# Altium project METR2800.PrjPcb
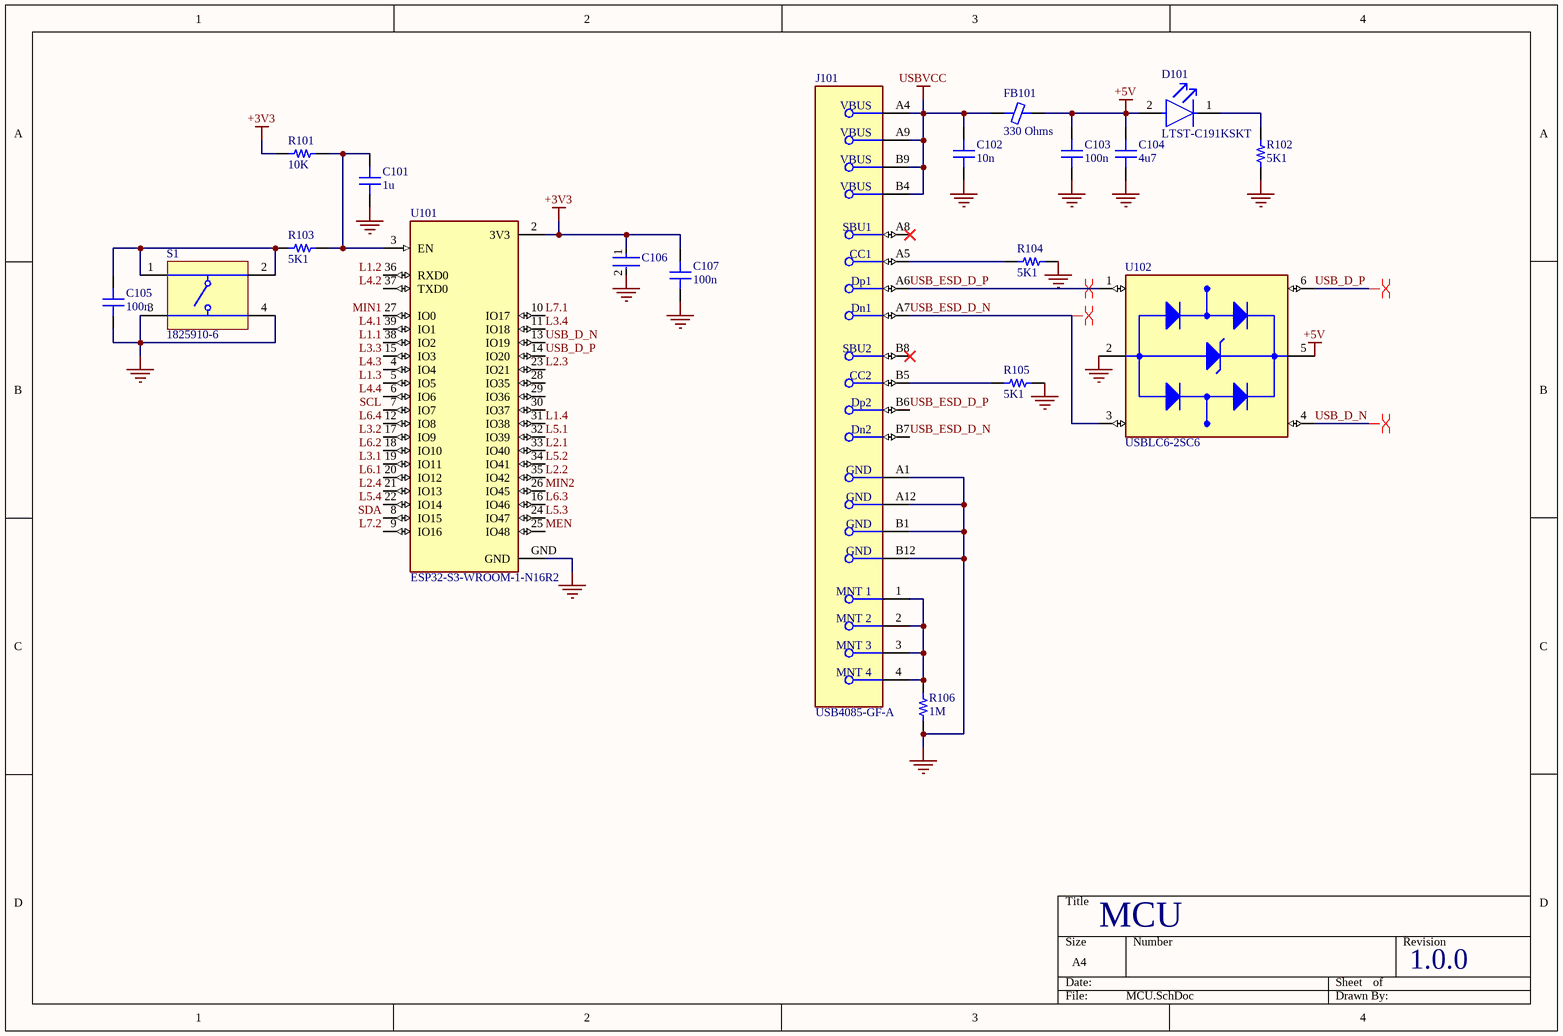
[diagram p0: MCU.SchDoc]
4 sheets, 150 parts. Net scope: global (net labels, ports and power ports of the same name join across sheets).
Board file: pcb.PcbDoc
Sheets:
  MCU.SchDoc
  Motors.SchDoc
  Limit Switches.SchDoc
  Power.SchDoc

## Sheet MCU.SchDoc
size A4; SheetNumber: 1; SheetTotal: 4

### Parts
C101  1u  [CAP 0402_1005]
C102  10n  [CAP 0402_1005]
C103  100n  [CAP 0402_1005]
C104  4u7  [CAP 0603_1608]
C105  100n  [CAP 0402_1005]
C106  C2012X5R1V226M125AC  [FP-C2012-125-0_2-IPC_C]  (value not drawn)
C107  100n  [CAP 0402_1005]
D101  LTST-C191KSKT  [FP-LTST-C191KSKT-MFG]
FB101  330 Ohms  [FER 0402_1005]
J101  USB4085-GF-A  [FP-USB4085-GF-A-MFG]
R101  10K  [RES 0402_1005]
R102  5K1  [RES 0402_1005]
R103  5K1  [RES 0402_1005]
R104  5K1  [RES 0402_1005]
R105  5K1  [RES 0402_1005]
R106  1M  [RES 0402_1005]
S1  1825910-6  [TECO-1825910-6_V]
U101  ESP32-S3-WROOM-1-N16R2  [XCVR_ESP32-S3-WROOM-1-N16R2]
U102  USBLC6-2SC6  [SOT95P280X145-6N]

### Nets
+3V3: C106.1 C107.2 R101.2 U101.2(3V3)
+5V: C103.2 C104.2 D101.2(A) FB101.2 U102.5(VBUS)
GND: C101.1 C102.1 C103.1 C104.1 C105.1 C106.2 C107.1 J101.A1(GND) J101.A12(GND) J101.B1(GND) J101.B12(GND) R102.1 R104.1 R105.1 R106.1 S1.3 S1.4 U101.GND U102.2(GND)
USBVCC: C102.2 FB101.1 J101.A4(VBUS) J101.A9(VBUS) J101.B4(VBUS) J101.B9(VBUS)
L1.1: U101.38(IO2)
L1.2: U101.36(RXD0)
L1.3: U101.5(IO5)
L1.4: U101.31(IO38)
L2.1: U101.33(IO40)
L2.2: U101.35(IO42)
L2.3: U101.23(IO21)
L2.4: U101.21(IO13)
L3.1: U101.19(IO11)
L3.2: U101.17(IO9)
L3.3: U101.15(IO3)
L3.4: U101.11(IO18)
L4.1: U101.39(IO1)
L4.2: U101.37(TXD0)
L4.3: U101.4(IO4)
L4.4: U101.6(IO6)
L5.1: U101.32(IO39)
L5.2: U101.34(IO41)
L5.3: U101.24(IO47)
L5.4: U101.22(IO14)
L6.1: U101.20(IO12)
L6.2: U101.18(IO10)
L6.3: U101.16(IO46)
L6.4: U101.12(IO8)
L7.1: U101.10(IO17)
L7.2: U101.9(IO16)
MEN: U101.25(IO48)
MIN1: U101.27(IO0)
MIN2: U101.26(IO45)
SCL: U101.7(IO7)
SDA: U101.8(IO15)
USB_D_N: U101.13(IO19) U102.4(I/O2_OUT)
USB_D_P: U101.14(IO20) U102.6(I/O1_OUT)
USB_ESD_D_N: J101.A7(Dn1) J101.B7(Dn2) U102.3(I/O2_IN)
USB_ESD_D_P: J101.A6(Dp1) J101.B6(Dp2) U102.1(I/O1_IN)
NetC101_2: C101.2 R101.1 R103.1 U101.3(EN)
NetC105_2: C105.2 R103.2 S1.1 S1.2
NetD101_1: D101.1(C) R102.2
NetJ101_1: J101.1(MNT_1) J101.2(MNT_2) J101.3(MNT_3) J101.4(MNT_4) R106.2
NetJ101_A5: J101.A5(CC1) R104.2
NetJ101_B5: J101.B5(CC2) R105.2

Not connected (* = marked no-connect by the designer): J101 A8(SBU1)* B8(SBU2)*; U101 28(IO35) 29(IO36) 30(IO37)

### Layout directives
differential pair: USB_D_N, USB_D_P, USB_ESD_D_N, USB_ESD_D_P

### Notes on the sheet
- MCU
- 1.0.0

### Library data of the parts
C101-C103 C105 C107 = CL05B104KP5VPNC: CAP CER 100NF 10V X7R 0402; manufacturer: Samsung Electro-Mechanics; Capacitance: 0.1 µF; Tolerance: ±10%; Part Number: CL05B104KP5VPNC; Applications: Automotive; componentlink1description: Datasheet; componentlink1url: https://mm.digikey.com/Volume0/opasdata/d220001/medias/docus/5458/CL05B104KP5VPNC_Spec.pdf; componentlink2description: DigiKey Link; componentlink2url: https://www.digikey.com/en/products/detail/samsung-electro-mechanics/CL05B104KP5VPNC/20498482; Device Package: 0402 (1005 Metric); lastupdated: 9/02/2024 8:03:17 PM; Lifecycle Status: Active; Minimum Order: 1; Mounting Type: Surface Mount, MLCC; Operating Temperature: -55°C ~ 125°C; Package / Case: 0402 (1005 Metric); packaging: TapeAndReel; partid: 56690; price: 0.01; Ratings: AEC-Q200; series: CL; Size / Dimension: 0.039" L x 0.020" W (1.00mm x 0.50mm); Supplier 1: DigiKey; Supplier Part Number 1: 1276-CL05B104KP5VPNCCT-ND; Temperature Coefficient: X7R; Thickness (Max): 0.022" (0.55mm); Voltage - Rated: 10V
  C101: Value: 1u
  C102: Value: 10n
  C103 C105 C107: Value: 100n
C104 = CL10A475KA8NQNC: CAP CER 4.7UF 25V X5R 0603; manufacturer: Samsung Electro-Mechanics; Capacitance: 4.7 µF; Tolerance: ±10%; Part Number: CL10A475KA8NQNC; Value: 4u7; Applications: General Purpose; componentlink1description: Datasheet; componentlink1url: http://www.samsungsem.com/kr/support/product-search/mlcc/CL10A475KA8NQNC.jsp; componentlink2description: DigiKey Link; componentlink2url: https://www.digikey.com/en/products/detail/samsung-electro-mechanics/CL10A475KA8NQNC/3887558; Device Package: 0603 (1608 Metric); lastupdated: 9/02/2024 8:10:30 PM; Lifecycle Status: Active; Minimum Order: 1; Mounting Type: Surface Mount, MLCC; Operating Temperature: -55°C ~ 85°C; Package / Case: 0603 (1608 Metric); packaging: TapeAndReel; partid: 2349; Part Status: Active; price: 0.06; series: CL; Size / Dimension: 0.063" L x 0.031" W (1.60mm x 0.80mm); Supplier 1: DigiKey; Supplier Part Number 1: 1276-1900-1-ND; Temperature Coefficient: X5R; Thickness (Max): 0.035" (0.90mm); Voltage - Rated: 25V
C106 = CMP-2000-06038-3: Multilayer Ceramic Capacitors 22μF ±20% 35V X5R SMD 0805; Capacitance: 22uF; Tolerance: 20%; RoHS Compliant: Yes; Height: 1.25mm; Termination: SMD/SMT; Case/Package: 0805; Thickness: 0.057inch; Max Operating Temperature: 85°C; Min Operating Temperature: -55°C; Voltage Rating (DC): 35V; Length: 0.079inch; Dielectric: X5R; Dielectric Material: Ceramic; Voltage Rating: 35V; Mount: Surface Mount; Package Quantity: 2000; Lead Free: Lead Free; Weight: 0.000194oz; REACH SVHC: No SVHC; Width: 0.049inch; Packaging: Tape and Reel; Series: C; Case Code (Metric): 2012; Case Code (Imperial): 0805
D101 = CMP-22017-000025-1: LED YELLOW CLEAR SMD; Dominant Wavelength: 597nm; Power Rating: 75mW; Number of LEDs: 1; Lens Style: Diffused; Forward Current: 30mA; Test Current: 20mA; Forward Voltage: 2.4V; Wavelength: 588nm; Viewing Angle: 130°; Lens Color: Colorless; Reverse Voltage: 5V; Luminous Intensity: 180mcd; Case Code (Imperial): 0603; Width: 0.8mm; Power Dissipation: 75mW; Length: 1.6mm; Illumination Color: Yellow; Number of Pins: 2; Case Code (Metric): 1608; Mount: Surface Mount; Number of Elements: 1; Height: 0.55mm; Lens Transparency: Clear; Depth: 0.8mm; Min Operating Temperature: -55°C; Case/Package: 0603; Radiation Hardening: No; Max Operating Temperature: 85°C; Package Quantity: 1; Packaging: Tape and Reel; Lead Free: Lead Free; Color: Yellow
FB101 = Z0402C121ASMST: FERRITE BEAD 120 OHM 0402 1LN; Manufacturer: KEMET; Current Rating (Max): 500mA; DC Resistance (DCR) (Max): 230mOhm; Filter Type: Signal Line; Impedance @ Frequency: 120 Ohms @ 100MHz; Number of Lines: 1; Value: 120 Ohms @ 100MHz; Part Number: Z0402C121ASMST; ComponentLink1Description: Datasheet; ComponentLink1URL: https://content.kemet.com/datasheets/F3115.pdf; ComponentLink2Description: DigiKey Link; ComponentLink2URL: http://digikey.com/product-detail/en/kemet/Z0402C121ASMST/399-17794-1-ND/8601457; Device Package: 0402 (1005 Metric); Height (Max): 0.022" (0.55mm); LastUpdated: 11/03/2024 7:42:43 AM; Lifecycle Status: Active; Minimum Order: 1; Mounting Type: Surface Mount; Operating Temperature: -55°C ~ 125°C; Package / Case: 0402 (1005 Metric); Packaging: TapeAndReel; PartId: 159; Part Status: Active; Price: 0.03; Series: Z-SMS; Size / Dimension: 0.039" L x 0.020" W (1.00mm x 0.50mm); Supplier 1: DigiKey; Supplier Part Number 1: 399-17794-1-ND
J101 = CMP-196119-000001-2: CONN RCPT USB2.0 TYPE C 24POS RA; Gender: Receptacle; Number of Positions: 16; USB Standard: USB 2.0; Orientation: Right Angle; Contact Plating: Gold; Contact Material: Copper Alloy
R101-R106 = AC0402JR-075K1L: RES SMD 5.1K OHM 5% 1/16W 0402; Manufacturer: Yageo; Power (Watts): 0.063W, 1/16W; Resistance: 5.1 kOhms; Temperature Coefficient: ±100ppm/°C; Part Number: AC0402JR-075K1L; ComponentLink1Description: Datasheet; ComponentLink1URL: https://www.yageo.com/upload/media/product/productsearch/datasheet/rchip/PYu-AC_51_RoHS_L_7.pdf; ComponentLink2Description: DigiKey Link; ComponentLink2URL: https://www.digikey.com/en/products/detail/yageo/AC0402JR-075K1L/5895695; Composition: Thick Film; Device Package: 0402 (1005 Metric); Features: Automotive AEC-Q200, Moisture Resistant; Height - Seated (Max): 0.015" (0.37mm); LastUpdated: 9/02/2024 8:30:14 PM; Lifecycle Status: Active; Minimum Order: 1; Number of Terminations: 2; Operating Temperature: -55°C ~ 155°C; Package / Case: 0402 (1005 Metric); Packaging: CutTape; PartId: 4690; Part Status: Active; Price: 0.01; Ratings: AEC-Q200; Series: AC; Size / Dimension: 0.039" L x 0.020" W (1.00mm x 0.50mm); Supplier 1: DigiKey; Supplier Part Number 1: YAG3554CT-ND; Supplier Device Package: 0402; Tolerance: ±5%
  R101: Value: 10K
  R102-R105: Value: 5K1
  R106: Value: 1M
S1 = CMP-1684-00021-1: Tact Switch, SPST-NO, 0.05 A, -35 to 85 degC, 4-Pin THD, RoHS, Bulk; Manufacturer: TE Connectivity; Maximum Contact Resistance: 100mOhm; Mechanical Life: 100000Cycles; Bushing Type: Unthreaded; Switch Configuration: OFF(ON); Maximum DC Voltage Rating: 24V; Contact Rating @ Voltage: 0.05A@24VDC; Actuator Color: Black; Body Orientation: Straight; Function: MomentaryContact; Illumination: N/R; Actuator Style: RoundButton; Actuator Material: PolybutyleneTerephthalate; Dielectric Strength: 500VAC; Pole Throw Configuration: SPST; Actuator Length: 1.4mm; Product Weight: N/A; Contact Material: CopperAlloy; Housing Material: N/A; Terminal Type: PCPins; Minimum Insulation Resistance: 100MOhm; Package Description: 4-Pin Through Hole Device, Body 5.99 x 5.99 mm, Pitch 6.5 mm; Part No: 1825910-6; Package Reference: THD; Base Material: N/A; Manufacturer URL: http://www.te.com; Contact Plating: Silver; RoHS: Yes; Datasheet Version: Rev. C9; Electrical Life: 100000Cycles; Maximum AC Voltage Rating: N/A; Thread Size: N/R; Operating Temperature: -35to85C; Mounting: ThroughHole; Dimension: 5.99x5mm; Datasheet URL: http://www.te.com/commerce/DocumentDelivery/DDEController?Action=showdoc&DocId=Customer+Drawing%7F1825910%7FC9%7Fpdf%7FEnglish%7FENG_CD_1825910_C9.pdf%7F1825910-6; Family: 1825910; Seal Location: N/A; Seal Description: N/A; Packaging: N/A
U101 = ESP32-S3-WROOM-1-N16R2: Bluetooth, WiFi 802.11b/g/n, Bluetooth v5.0 Transceiver Module 2.4GHz PCB Trace Surface Mount; MF: Espressif Systems; MP: ESP32S3WROOM1N16R2; SnapEDA_Link: https://www.snapeda.com/parts/ESP32S3WROOM1N16R2/Espressif+Systems/view-part/?ref=snap; Package: NON STANDARD Espressif Systems; Value: *; Check_prices: https://www.snapeda.com/parts/ESP32S3WROOM1N16R2/Espressif+Systems/view-part/?ref=eda
U102 = USBLC6-2SC6: 17V Clamp 5A (8/20Âµs) Ipp Tvs Diode Surface Mount SOT-23-6; MF: STMicroelectronics; Value: *; SnapEDA_Link: https://www.snapeda.com/parts/USBLC6-2SC6/STMicroelectronics/view-part/?ref=snap; Check_prices: https://www.snapeda.com/parts/USBLC6-2SC6/STMicroelectronics/view-part/?ref=eda; Purchase-URL: https://pricing.snapeda.com/search/part/USBLC6-2SC6/?ref=eda; Price: None; Availability: In Stock; Package: SOT-23-6 STMicroelectronics; MP: USBLC6-2SC6

## Sheet Motors.SchDoc
size A4; SheetNumber: 2; SheetTotal: 4
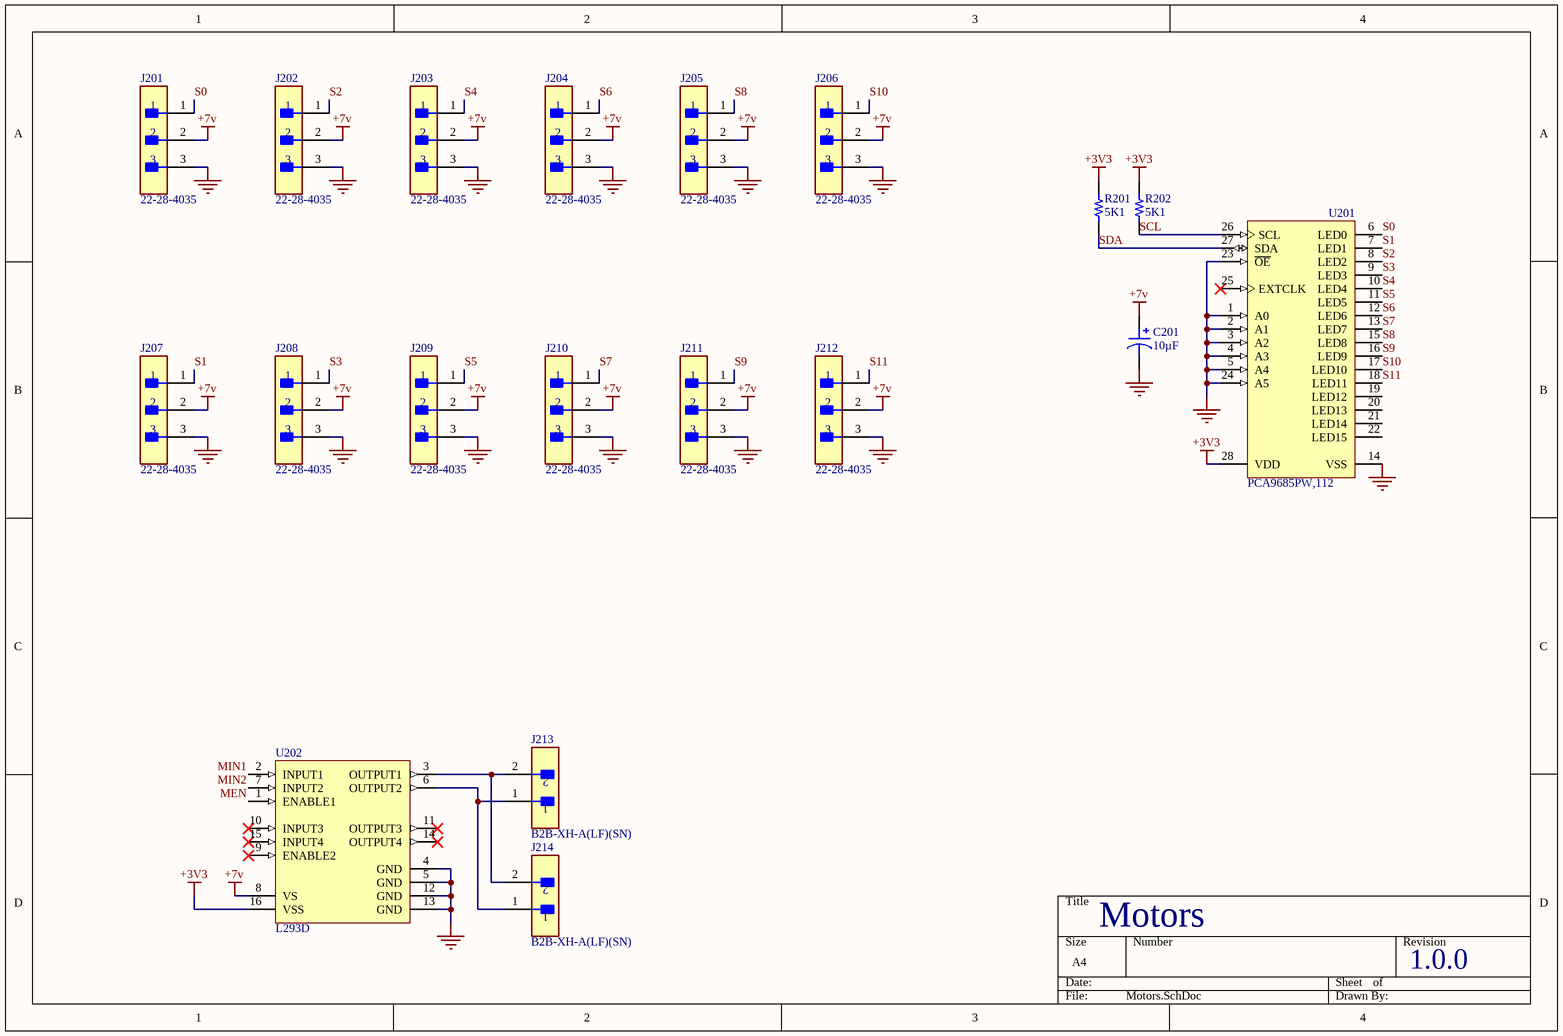
[diagram p1: Motors.SchDoc]

### Parts
C201  10µF  [CAP TH ALUM ELEC D10.00mm S5.00mm H12.50mm]
J201  22-28-4035  [FP-22-28-4035-MFG]
J202  22-28-4035  [FP-22-28-4035-MFG]
J203  22-28-4035  [FP-22-28-4035-MFG]
J204  22-28-4035  [FP-22-28-4035-MFG]
J205  22-28-4035  [FP-22-28-4035-MFG]
J206  22-28-4035  [FP-22-28-4035-MFG]
J207  22-28-4035  [FP-22-28-4035-MFG]
J208  22-28-4035  [FP-22-28-4035-MFG]
J209  22-28-4035  [FP-22-28-4035-MFG]
J210  22-28-4035  [FP-22-28-4035-MFG]
J211  22-28-4035  [FP-22-28-4035-MFG]
J212  22-28-4035  [FP-22-28-4035-MFG]
J213  B2B-XH-A(LF)(SN)  [FP-B2B-XH-A_LF_SN-MFG]
J214  B2B-XH-A(LF)(SN)  [FP-B2B-XH-A_LF_SN-MFG]
R201  5K1  [RES 0402_1005]
R202  5K1  [RES 0402_1005]
U201  PCA9685PW,112  [SOT361-1_V]
U202  L293D  [STM-L293D-16]

### Nets
+3V3: R201.2 R202.1 U201.28(VDD) U202.16(VSS)
+7v: C201.1 J201.2 J202.2 J203.2 J204.2 J205.2 J206.2 J207.2 J208.2 J209.2 J210.2 J211.2 J212.2 U202.8(VS)
GND: C201.2 J201.3 J202.3 J203.3 J204.3 J205.3 J206.3 J207.3 J208.3 J209.3 J210.3 J211.3 J212.3 U201.1(A0) U201.2(A1) U201.3(A2) U201.4(A3) U201.5(A4) U201.14(VSS) U201.23(~{OE}) U201.24(A5) U202.4(GND) U202.5(GND) U202.12(GND) U202.13(GND)
MEN: U202.1(ENABLE1)
MIN1: U202.2(INPUT1)
MIN2: U202.7(INPUT2)
S0: J201.1 U201.6(LED0)
S1: J207.1 U201.7(LED1)
S2: J202.1 U201.8(LED2)
S3: J208.1 U201.9(LED3)
S4: J203.1 U201.10(LED4)
S5: J209.1 U201.11(LED5)
S6: J204.1 U201.12(LED6)
S7: J210.1 U201.13(LED7)
S8: J205.1 U201.15(LED8)
S9: J211.1 U201.16(LED9)
S10: J206.1 U201.17(LED10)
S11: J212.1 U201.18(LED11)
SCL: R202.2 U201.26(SCL)
SDA: R201.1 U201.27(SDA)
NetJ213_1: J213.1 J214.1 U202.6(OUTPUT2)
NetJ213_2: J213.2 J214.2 U202.3(OUTPUT1)

Not connected (* = marked no-connect by the designer): U201 19(LED12) 20(LED13) 21(LED14) 22(LED15) 25(EXTCLK)*; U202 9(ENABLE2)* 10(INPUT3)* 11(OUTPUT3)* 14(OUTPUT4)* 15(INPUT4)*

### Notes on the sheet
- Motors
- 1.0.0

### Library data of the parts
C201 = UVR2D100MPD: CAP ALUM 10UF 20% 200V RADIAL; manufacturer: Nichicon; Lifetime @ Temp.: 2000 Hrs @ 85°C; Polarization: Polar; Ripple Current @ High Frequency: 152mA @ 10kHz; Ripple Current @ Low Frequency: 95mA @ 120Hz; Part Number: UVR2D100MPD; Applications: General Purpose; Capacitance: 10µF; componentlink1description: Datasheet; componentlink1url: http://nichicon-us.com/english/products/pdfs/e-uvr.pdf; componentlink2description: DigiKey Link; componentlink2url: http://digikey.com/product-detail/en/nichicon/UVR2D100MPD/493-1177-ND/588918; Device Package: Radial, Can; Height - Seated (Max): 0.492" (12.50mm); lastupdated: 2/09/2020 1:31:04 AM; Lead Spacing: 0.197" (5.00mm); Lifecycle Status: Active; Minimum Order: 1; Mounting Type: Through Hole; Operating Temperature: -40°C ~ 85°C; Package / Case: Radial, Can; packaging: Bulk; partid: 10668; Part Status: Active; price: 0.45; series: UVR; Size / Dimension: 0.394" Dia (10.00mm); Supplier 1: DigiKey; Supplier Part Number 1: 493-1177-ND; Tolerance: ±20%; value: 10µF; Voltage - Rated: 200V
J201-J212 = CMP-00257-00247547-1: 22-28-4035 BOARD-BOARD Connector HEADER, 3WAY, 1ROW; Series: KK; Pitch Spacing: 2.54mm; No. of Rows: 1;; Manufacturer Lifecycle Status: ACTIVE; NexarPartId: 247547; Plating: Tin; Max Voltage Rating (DC): 250.25kV; Voltage Rating: 250V; Current Rating: 4A; Gender: Male; Glow Wire Compliant: Non-compliant; Number of Positions: 3; Connector Type: Male Pin; Contact Resistance: 20mΩ; Color: Black; Contact Plating: Gold; Contact Material: Brass; Lead Free: Lead Free; Number of Rows: 1; Housing Material: Thermoplastic; Min Operating Temperature: 0°C; Country of Origin: US; REACH SVHC: Unknown; Lifecycle Status: Production; Mount: Through Hole; Schedule B: 8536694040; RoHS: Compliant; Termination: Through Hole; Max Operating Temperature: 75°C; Pitch: 2.54mm; Packaging: Bulk; Number of Circuits: 3; Contact Mating Length: 7.493mm; Orientation: Vertical; Housing Color: Black; Number of Contacts: 3
J213 J214 = CMP-2000-05888-3: CONN HEADER VERT 2POS 2.5MM; Current Rating: 3A; Voltage Rating: 250V; Number of Contacts: 2; Contact Resistance: 20mR; Wire/Cable Gauge: 22AWG; Insulation Resistance: 1GR; Connector Type: Male Pin; Packaging: Bulk; Contact Material: Brass; Lead Free: Lead Free; Orientation: Straight; Contact Plating: Tin; Max Current Rating: 3A; Termination: Solder; Fastening Type: Detent; Depth: 5.75mm; Housing Material: Polyamide; REACH SVHC: No SVHC; Series: XH; Voltage Rating (AC): 250V; Number of Positions: 2; Color: Natural; Contact Type: Male Pin; Max Voltage Rating (DC): 250V; Pitch: 2.5mm; Lead Pitch: 2.5mm; Mount: Through Hole; Max Operating Temperature: 85°C; Length: 7.4mm; Max Voltage Rating (AC): 250V; Min Operating Temperature: -25°C; Number of Rows: 1; Housing Color: White
R201 R202 = AC0402JR-075K1L: as R101 on sheet MCU; Part Number: AC0402JR-075K1L; Value: 5K1; ComponentLink1Description: Datasheet; ComponentLink1URL: https://www.yageo.com/upload/media/product/productsearch/datasheet/rchip/PYu-AC_51_RoHS_L_7.pdf; ComponentLink2Description: DigiKey Link; ComponentLink2URL: https://www.digikey.com/en/products/detail/yageo/AC0402JR-075K1L/5895695; Composition: Thick Film; Device Package: 0402 (1005 Metric); Features: Automotive AEC-Q200, Moisture Resistant; Height - Seated (Max): 0.015" (0.37mm); LastUpdated: 9/02/2024 8:30:14 PM; Lifecycle Status: Active; Minimum Order: 1; Number of Terminations: 2; Operating Temperature: -55°C ~ 155°C; Package / Case: 0402 (1005 Metric); Packaging: CutTape; PartId: 4690; Part Status: Active; Price: 0.01; Ratings: AEC-Q200; Series: AC; Size / Dimension: 0.039" L x 0.020" W (1.00mm x 0.50mm); Supplier 1: DigiKey; Supplier Part Number 1: YAG3554CT-ND; Supplier Device Package: 0402; Tolerance: ±5%
U201 = CMP-1595-00004-2: 16-Channel, 12-Bit PWM Fm+ I2C-Bus LED Controller, 2.3 to 5.5 V, -40 to 85 degC, 28-Pin TSSOP (SOT361-1), RoHS, Tape and Reel; Supply Current Max: 10 mA; Supply Voltage Min: 2.3 V; Supply Voltage Max: 5.5 V; Frequency: 25000000 Hz; Temperature Min: -40 degC; PackageDescription: 28-Pin Small Outline Package, Body 9.7 x 4.4 mm, Pitch 0.65 mm; RoHS: TRUE; ComponentLink1Description: Manufacturer URL; Code_JEDEC: MO-153; PartNumber: PCA9685; ComponentLink2URL: http://www.nxp.com/documents/data_sheet/PCA9685.pdf; Packing: Tape and Reel; ComponentLink1URL: http://www.nxp.com/; ComponentLink3Description: Package Specification; ComponentLink2Description: Datasheet; ComponentLink3URL: http://www.nxp.com/documents/outline_drawing/sot361-1_po.pdf; DatasheetVersion: Rev. 4; Temperature Max: 85 degC; PackageVersion: 02/2003; Mounting Technology: Surface Mount
U202 = CMP-2000-06524-1: Push-Pull Four Channel Driver with Diode, 4.5 to 36 V, -40 to 150 degC, 16-Pin PDIP, RoHS, Tube; Manufacturer: STMicroelectronics; Number of Outputs: 4; Current - Peak Output: 1.2A; Current - Output / Channel: 600mA; Input Type: Non-Inverting; Other Related Documents: L293DViewAllSpecifications; Dynamic Catalog: HalfBridge; Voltage - Supply: 4.5V~36V; Other Names: 497-2936-5; Package / Case: 16-DIP(0.300",7.62mm); PartNumber: L293D; Operating Temperature: -40°C~150°C; Datasheet URL: http://www.st.com/st-web-ui/static/active/en/resource/technical/document/datasheet/CD00000059.pdf; Supplier Device Package: 16-PowerDIP; Packaging: Tube; Package Description: 16-Pin Thru-Hole Dual-In-Line, Body 20 x 6.85 mm, Pitch 2.54 mm; Standard Package: 25; Datasheet Version: 07/2003; On-State Resistance: -; Manufacturer URL: http://www.st.com/; Category: IntegratedCircuits(ICs); Family: PMIC-MOSFET,BridgeDrivers-InternalSwitch; Type: HalfBridge; Series: -; Mounting Technology: ThroughHole; Package Reference: DIP-16; Mounting Type: ThroughHole

## Sheet Limit Switches.SchDoc
size A4; SheetNumber: 3; SheetTotal: 4
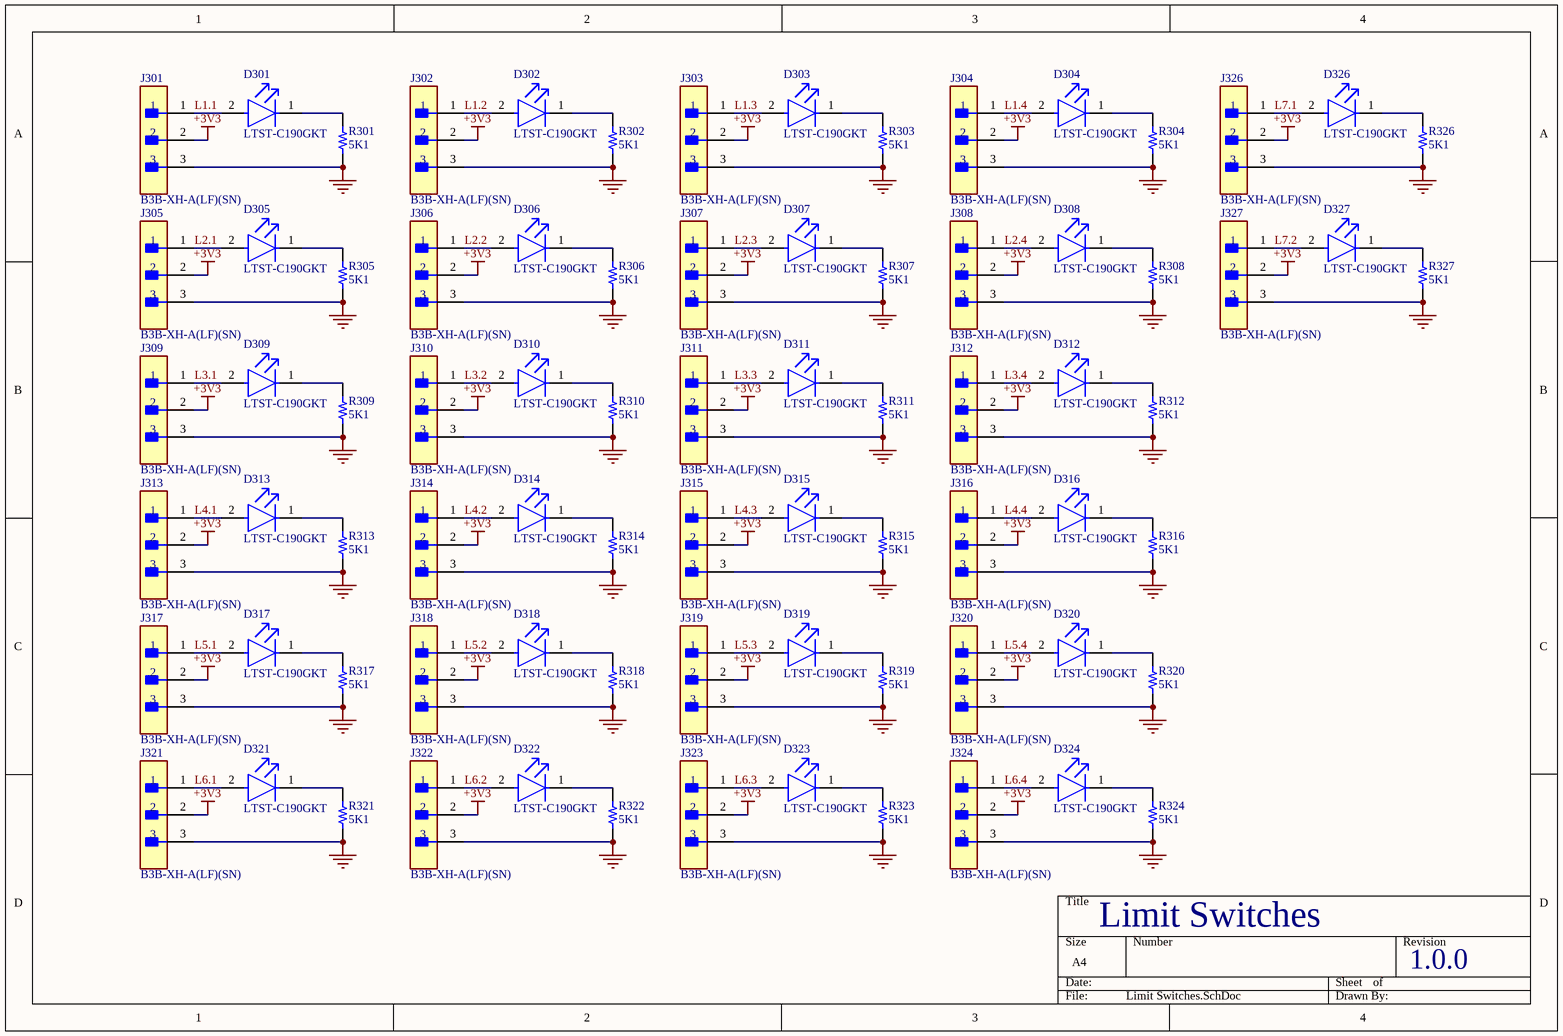
[diagram p2: Limit Switches.SchDoc]

### Parts
D301  LTST-C190GKT  [FP-LTST-C190GKT-MFG]
D302  LTST-C190GKT  [FP-LTST-C190GKT-MFG]
D303  LTST-C190GKT  [FP-LTST-C190GKT-MFG]
D304  LTST-C190GKT  [FP-LTST-C190GKT-MFG]
D305  LTST-C190GKT  [FP-LTST-C190GKT-MFG]
D306  LTST-C190GKT  [FP-LTST-C190GKT-MFG]
D307  LTST-C190GKT  [FP-LTST-C190GKT-MFG]
D308  LTST-C190GKT  [FP-LTST-C190GKT-MFG]
D309  LTST-C190GKT  [FP-LTST-C190GKT-MFG]
D310  LTST-C190GKT  [FP-LTST-C190GKT-MFG]
D311  LTST-C190GKT  [FP-LTST-C190GKT-MFG]
D312  LTST-C190GKT  [FP-LTST-C190GKT-MFG]
D313  LTST-C190GKT  [FP-LTST-C190GKT-MFG]
D314  LTST-C190GKT  [FP-LTST-C190GKT-MFG]
D315  LTST-C190GKT  [FP-LTST-C190GKT-MFG]
D316  LTST-C190GKT  [FP-LTST-C190GKT-MFG]
D317  LTST-C190GKT  [FP-LTST-C190GKT-MFG]
D318  LTST-C190GKT  [FP-LTST-C190GKT-MFG]
D319  LTST-C190GKT  [FP-LTST-C190GKT-MFG]
D320  LTST-C190GKT  [FP-LTST-C190GKT-MFG]
D321  LTST-C190GKT  [FP-LTST-C190GKT-MFG]
D322  LTST-C190GKT  [FP-LTST-C190GKT-MFG]
D323  LTST-C190GKT  [FP-LTST-C190GKT-MFG]
D324  LTST-C190GKT  [FP-LTST-C190GKT-MFG]
D326  LTST-C190GKT  [FP-LTST-C190GKT-MFG]
D327  LTST-C190GKT  [FP-LTST-C190GKT-MFG]
J301  B3B-XH-A(LF)(SN)  [FP-B3B-XH-A_LF_SN-MFG]
J302  B3B-XH-A(LF)(SN)  [FP-B3B-XH-A_LF_SN-MFG]
J303  B3B-XH-A(LF)(SN)  [FP-B3B-XH-A_LF_SN-MFG]
J304  B3B-XH-A(LF)(SN)  [FP-B3B-XH-A_LF_SN-MFG]
J305  B3B-XH-A(LF)(SN)  [FP-B3B-XH-A_LF_SN-MFG]
J306  B3B-XH-A(LF)(SN)  [FP-B3B-XH-A_LF_SN-MFG]
J307  B3B-XH-A(LF)(SN)  [FP-B3B-XH-A_LF_SN-MFG]
J308  B3B-XH-A(LF)(SN)  [FP-B3B-XH-A_LF_SN-MFG]
J309  B3B-XH-A(LF)(SN)  [FP-B3B-XH-A_LF_SN-MFG]
J310  B3B-XH-A(LF)(SN)  [FP-B3B-XH-A_LF_SN-MFG]
J311  B3B-XH-A(LF)(SN)  [FP-B3B-XH-A_LF_SN-MFG]
J312  B3B-XH-A(LF)(SN)  [FP-B3B-XH-A_LF_SN-MFG]
J313  B3B-XH-A(LF)(SN)  [FP-B3B-XH-A_LF_SN-MFG]
J314  B3B-XH-A(LF)(SN)  [FP-B3B-XH-A_LF_SN-MFG]
J315  B3B-XH-A(LF)(SN)  [FP-B3B-XH-A_LF_SN-MFG]
J316  B3B-XH-A(LF)(SN)  [FP-B3B-XH-A_LF_SN-MFG]
J317  B3B-XH-A(LF)(SN)  [FP-B3B-XH-A_LF_SN-MFG]
J318  B3B-XH-A(LF)(SN)  [FP-B3B-XH-A_LF_SN-MFG]
J319  B3B-XH-A(LF)(SN)  [FP-B3B-XH-A_LF_SN-MFG]
J320  B3B-XH-A(LF)(SN)  [FP-B3B-XH-A_LF_SN-MFG]
J321  B3B-XH-A(LF)(SN)  [FP-B3B-XH-A_LF_SN-MFG]
J322  B3B-XH-A(LF)(SN)  [FP-B3B-XH-A_LF_SN-MFG]
J323  B3B-XH-A(LF)(SN)  [FP-B3B-XH-A_LF_SN-MFG]
J324  B3B-XH-A(LF)(SN)  [FP-B3B-XH-A_LF_SN-MFG]
J326  B3B-XH-A(LF)(SN)  [FP-B3B-XH-A_LF_SN-MFG]
J327  B3B-XH-A(LF)(SN)  [FP-B3B-XH-A_LF_SN-MFG]
R301  5K1  [RES 0402_1005]
R302  5K1  [RES 0402_1005]
R303  5K1  [RES 0402_1005]
R304  5K1  [RES 0402_1005]
R305  5K1  [RES 0402_1005]
R306  5K1  [RES 0402_1005]
R307  5K1  [RES 0402_1005]
R308  5K1  [RES 0402_1005]
R309  5K1  [RES 0402_1005]
R310  5K1  [RES 0402_1005]
R311  5K1  [RES 0402_1005]
R312  5K1  [RES 0402_1005]
R313  5K1  [RES 0402_1005]
R314  5K1  [RES 0402_1005]
R315  5K1  [RES 0402_1005]
R316  5K1  [RES 0402_1005]
R317  5K1  [RES 0402_1005]
R318  5K1  [RES 0402_1005]
R319  5K1  [RES 0402_1005]
R320  5K1  [RES 0402_1005]
R321  5K1  [RES 0402_1005]
R322  5K1  [RES 0402_1005]
R323  5K1  [RES 0402_1005]
R324  5K1  [RES 0402_1005]
R326  5K1  [RES 0402_1005]
R327  5K1  [RES 0402_1005]

### Nets
+3V3: J301.2 J302.2 J303.2 J304.2 J305.2 J306.2 J307.2 J308.2 J309.2 J310.2 J311.2 J312.2 J313.2 J314.2 J315.2 J316.2 J317.2 J318.2 J319.2 J320.2 J321.2 J322.2 J323.2 J324.2 J326.2 J327.2
GND: J301.3 J302.3 J303.3 J304.3 J305.3 J306.3 J307.3 J308.3 J309.3 J310.3 J311.3 J312.3 J313.3 J314.3 J315.3 J316.3 J317.3 J318.3 J319.3 J320.3 J321.3 J322.3 J323.3 J324.3 J326.3 J327.3 R301.1 R302.1 R303.1 R304.1 R305.1 R306.1 R307.1 R308.1 R309.1 R310.1 R311.1 R312.1 R313.1 R314.1 R315.1 R316.1 R317.1 R318.1 R319.1 R320.1 R321.1 R322.1 R323.1 R324.1 R326.1 R327.1
L1.1: D301.2(A) J301.1
L1.2: D302.2(A) J302.1
L1.3: D303.2(A) J303.1
L1.4: D304.2(A) J304.1
L2.1: D305.2(A) J305.1
L2.2: D306.2(A) J306.1
L2.3: D307.2(A) J307.1
L2.4: D308.2(A) J308.1
L3.1: D309.2(A) J309.1
L3.2: D310.2(A) J310.1
L3.3: D311.2(A) J311.1
L3.4: D312.2(A) J312.1
L4.1: D313.2(A) J313.1
L4.2: D314.2(A) J314.1
L4.3: D315.2(A) J315.1
L4.4: D316.2(A) J316.1
L5.1: D317.2(A) J317.1
L5.2: D318.2(A) J318.1
L5.3: D319.2(A) J319.1
L5.4: D320.2(A) J320.1
L6.1: D321.2(A) J321.1
L6.2: D322.2(A) J322.1
L6.3: D323.2(A) J323.1
L6.4: D324.2(A) J324.1
L7.1: D326.2(A) J326.1
L7.2: D327.2(A) J327.1
NetD301_1: D301.1(C) R301.2
NetD302_1: D302.1(C) R302.2
NetD303_1: D303.1(C) R303.2
NetD304_1: D304.1(C) R304.2
NetD305_1: D305.1(C) R305.2
NetD306_1: D306.1(C) R306.2
NetD307_1: D307.1(C) R307.2
NetD308_1: D308.1(C) R308.2
NetD309_1: D309.1(C) R309.2
NetD310_1: D310.1(C) R310.2
NetD311_1: D311.1(C) R311.2
NetD312_1: D312.1(C) R312.2
NetD313_1: D313.1(C) R313.2
NetD314_1: D314.1(C) R314.2
NetD315_1: D315.1(C) R315.2
NetD316_1: D316.1(C) R316.2
NetD317_1: D317.1(C) R317.2
NetD318_1: D318.1(C) R318.2
NetD319_1: D319.1(C) R319.2
NetD320_1: D320.1(C) R320.2
NetD321_1: D321.1(C) R321.2
NetD322_1: D322.1(C) R322.2
NetD323_1: D323.1(C) R323.2
NetD324_1: D324.1(C) R324.2
NetD326_1: D326.1(C) R326.2
NetD327_1: D327.1(C) R327.2

### Notes on the sheet
- Limit Switches
- 1.0.0

### Library data of the parts
D301-D324 D326 D327 = CMP-22017-000005-2: LED GREEN CLEAR CHIP SMD; Dominant Wavelength: 569nm; Reverse Voltage: 5V; Lens Color: Colorless; Viewing Angle: 130°; Voltage: 2V; Forward Current: 30mA; Power Dissipation: 100mW; Luminous Intensity: 6mcd; Number of LEDs: 1; Forward Voltage: 2.1V; Wavelength: 565nm; Test Current: 10mA; Min Operating Temperature: -55°C; Lens Style: Clear; Mount: Surface Mount; Width: 0.8mm; Packaging: Tape and Reel; Lens Transparency: Clear; Case Code (Metric): 1608; Depth: 0.8mm; Case Code (Imperial): 0603; Case/Package: 0603; Number of Pins: 2; Max Operating Temperature: 85°C; Lead Free: Lead Free; Number of Elements: 1; Length: 1.6mm; Height: 0.8mm; Package Quantity: 1; Power Rating: 100mW; Radiation Hardening: No; Illumination Color: Green; Color: Green
J301-J324 J326 J327 = CMP-17439-000014-3: CONN HEADER VERT 3POS 2.5MM; Max Voltage Rating (DC): 250V; Number of Positions: 3; Current Rating: 3A; Gender: Male; Wire/Cable Gauge: 22AWG; Contact Resistance: 20mR; Insulation Resistance: 1GR; Insulation Material: Nylon; Contact Plating: Tin; Depth: 5.75mm; Contact Type: Male Pin; Max Operating Temperature: 85°C; Insulation Color: Natural; Voltage Rating (AC): 250V; Color: Natural; Connector Type: Header; Orientation: Straight; Fastening Type: Detent; Housing Color: White; Min Operating Temperature: -25°C; Termination: Solder; Voltage Rating: 250V; Series: XH; Pitch: 2.5mm; Contact Shape: Square; Number of Rows: 1; Lead Free: Lead Free; Packaging: Bulk; Mount: Through Hole; Flammability Rating: UL94 V-0; Max Voltage Rating (AC): 250V; REACH SVHC: No SVHC; Housing Material: Polyamide; Contact Material: Brass; Lead Pitch: 2.5mm; Contact Finish - Mating: TIN; Length: 9.9mm; Max Current Rating: 3A; Number of Contacts: 3
R301-R324 R326 R327 = AC0402JR-075K1L: as R101 on sheet MCU; Part Number: AC0402JR-075K1L; Value: 5K1; ComponentLink1Description: Datasheet; ComponentLink1URL: https://www.yageo.com/upload/media/product/productsearch/datasheet/rchip/PYu-AC_51_RoHS_L_7.pdf; ComponentLink2Description: DigiKey Link; ComponentLink2URL: https://www.digikey.com/en/products/detail/yageo/AC0402JR-075K1L/5895695; Composition: Thick Film; Device Package: 0402 (1005 Metric); Features: Automotive AEC-Q200, Moisture Resistant; Height - Seated (Max): 0.015" (0.37mm); LastUpdated: 9/02/2024 8:30:14 PM; Lifecycle Status: Active; Minimum Order: 1; Number of Terminations: 2; Operating Temperature: -55°C ~ 155°C; Package / Case: 0402 (1005 Metric); Packaging: CutTape; PartId: 4690; Part Status: Active; Price: 0.01; Ratings: AEC-Q200; Series: AC; Size / Dimension: 0.039" L x 0.020" W (1.00mm x 0.50mm); Supplier 1: DigiKey; Supplier Part Number 1: YAG3554CT-ND; Supplier Device Package: 0402; Tolerance: ±5%

## Sheet Power.SchDoc
size A4; SheetNumber: 4; SheetTotal: 4
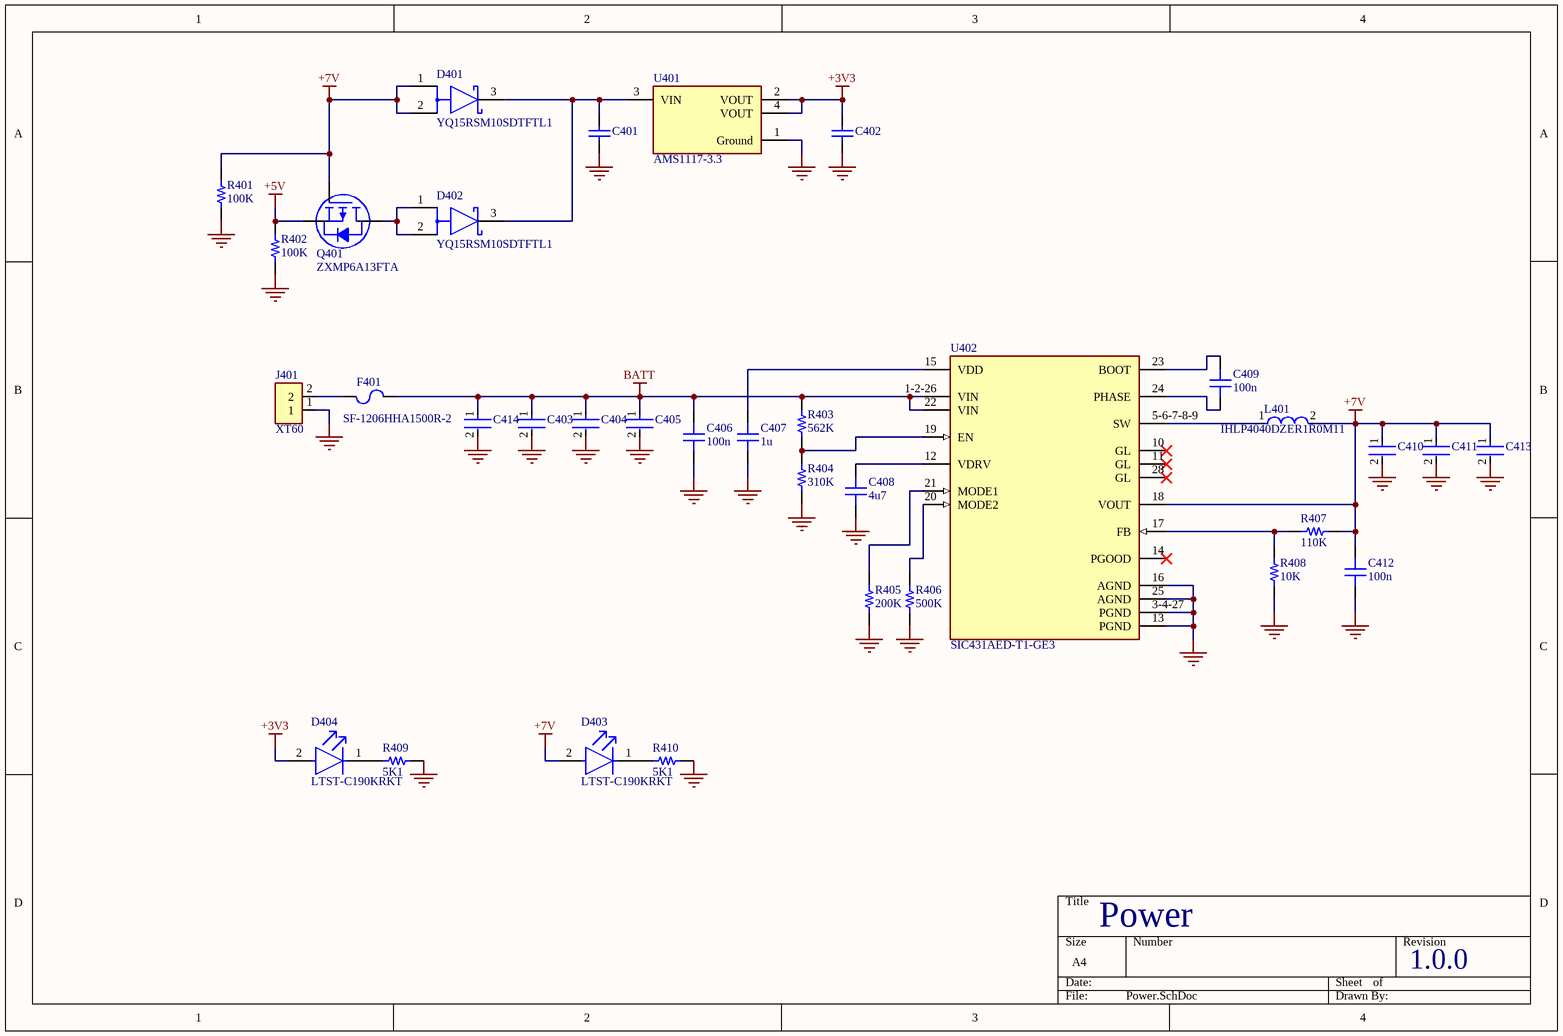
[diagram p3: Power.SchDoc]

### Parts
C401  T529P226M010AAE200  [CAPC2013X100X55ML10T10]  (value not drawn)
C402  T529P226M010AAE200  [CAPC2013X100X55ML10T10]  (value not drawn)
C403  C2012X5R1V226M125AC  [FP-C2012-125-0_2-IPC_C]  (value not drawn)
C404  C2012X5R1V226M125AC  [FP-C2012-125-0_2-IPC_C]  (value not drawn)
C405  C2012X5R1V226M125AC  [FP-C2012-125-0_2-IPC_C]  (value not drawn)
C406  100n  [CAP 0402_1005]
C407  1u  [CAP 0402_1005]
C408  4u7  [CAP 0603_1608]
C409  100n  [CAP 0402_1005]
C410  C2012X5R1V226M125AC  [FP-C2012-125-0_2-IPC_C]  (value not drawn)
C411  C2012X5R1V226M125AC  [FP-C2012-125-0_2-IPC_C]  (value not drawn)
C412  100n  [CAP 0402_1005]
C413  C2012X5R1V226M125AC  [FP-C2012-125-0_2-IPC_C]  (value not drawn)
C414  C2012X5R1V226M125AC  [FP-C2012-125-0_2-IPC_C]  (value not drawn)
D401  YQ15RSM10SDTFTL1  [FP-95570-MFG]
D402  YQ15RSM10SDTFTL1  [FP-95570-MFG]
D403  LTST-C190KRKT  [FP-LTST-C190KRKT-MFG]
D404  LTST-C190KRKT  [FP-LTST-C190KRKT-MFG]
F401  SF-1206HHA1500R-2  [FUSE 1206_3216 0.6MM]
J401  XT60  [AMASS_XT60PB-M]
L401  IHLP4040DZER1R0M11  [FP-IHLP-4040DZ-FP_3_175x4-MFG]
Q401  ZXMP6A13FTA  [DIODES SOT-23-3]
R401  100K  [RES 0402_1005]
R402  100K  [RES 0402_1005]
R403  562K  [RES 0402_1005]
R404  310K  [RES 0402_1005]
R405  200K  [RES 0402_1005]
R406  500K  [RES 0402_1005]
R407  110K  [RES 0402_1005]
R408  10K  [RES 0402_1005]
R409  5K1  [RES 0402_1005]
R410  5K1  [RES 0402_1005]
U401  AMS1117-3.3  [FP-AMS1117-IPC_C]
U402  SIC431AED-T1-GE3  [FP-T22-0442-MFG]

### Nets
+3V3: C402.2 D404.2(A) U401.2(VOUT) U401.4(VOUT)
+5V: Q401.2(S) R402.2
+7v: C410.1 C411.1 C412.2 C413.1 D401.1(A) D401.2(A) D403.2(A) L401.2 Q401.1(G) R401.2 R407.1 U402.18(VOUT)
BATT: C403.1 C404.1 C405.1 C406.2 C414.1 F401.2 R403.1 U402.1-2-26(VIN) U402.22(VIN)
GND: C401.1 C402.1 C403.2 C404.2 C405.2 C406.1 C407.1 C408.1 C410.2 C411.2 C412.1 C413.2 C414.2 J401.1 R401.1 R402.1 R404.2 R405.2 R406.2 R408.2 R409.1 R410.1 U401.1(Ground) U402.3-4-27(PGND) U402.13(PGND) U402.16(AGND) U402.25(AGND)
NetC401_2: C401.2 D401.3(C) D402.3(C) U401.3(VIN)
NetC407_2: C407.2 U402.15(VDD)
NetC408_2: C408.2 U402.12(VDRV)
NetC409_1: C409.1 U402.24(PHASE)
NetC409_2: C409.2 U402.23(BOOT)
NetD402_1: D402.1(A) D402.2(A) Q401.3(D)
NetD403_1: D403.1(C) R410.2
NetD404_1: D404.1(C) R409.2
NetF401_1: F401.1 J401.2
NetL401_1: L401.1 U402.5-6-7-8-9(SW)
NetR403_2: R403.2 R404.1 U402.19(EN)
NetR405_1: R405.1 U402.21(MODE1)
NetR406_1: R406.1 U402.20(MODE2)
NetR407_2: R407.2 R408.1 U402.17(FB)

Not connected (* = marked no-connect by the designer): U402 10(GL)* 11(GL)* 14(PGOOD)* 28(GL)*

### Notes on the sheet
- Power
- 1.0.0

### Library data of the parts
C401 C402 = CMP-2007-03671-1: Manufacturer: Kemet; Part Number: T529P226M010AAE200
C403-C405 C410 C411 C413 C414 = CMP-2000-06038-3: as C106 on sheet MCU; Tolerance: 20%; RoHS Compliant: Yes; Height: 1.25mm; Termination: SMD/SMT; Case/Package: 0805; Thickness: 0.057inch; Max Operating Temperature: 85°C; Min Operating Temperature: -55°C; Voltage Rating (DC): 35V; Length: 0.079inch; Dielectric: X5R; Dielectric Material: Ceramic; Voltage Rating: 35V; Mount: Surface Mount; Package Quantity: 2000; Lead Free: Lead Free; Weight: 0.000194oz; REACH SVHC: No SVHC; Width: 0.049inch; Packaging: Tape and Reel; Series: C; Case Code (Metric): 2012; Case Code (Imperial): 0805
C406 C407 C409 C412 = CL05B104KP5VPNC: as C101 on sheet MCU; Part Number: CL05B104KP5VPNC; Applications: Automotive; componentlink1description: Datasheet; componentlink1url: https://mm.digikey.com/Volume0/opasdata/d220001/medias/docus/5458/CL05B104KP5VPNC_Spec.pdf; componentlink2description: DigiKey Link; componentlink2url: https://www.digikey.com/en/products/detail/samsung-electro-mechanics/CL05B104KP5VPNC/20498482; Device Package: 0402 (1005 Metric); lastupdated: 9/02/2024 8:03:17 PM; Lifecycle Status: Active; Minimum Order: 1; Mounting Type: Surface Mount, MLCC; Operating Temperature: -55°C ~ 125°C; Package / Case: 0402 (1005 Metric); packaging: TapeAndReel; partid: 56690; price: 0.01; Ratings: AEC-Q200; series: CL; Size / Dimension: 0.039" L x 0.020" W (1.00mm x 0.50mm); Supplier 1: DigiKey; Supplier Part Number 1: 1276-CL05B104KP5VPNCCT-ND; Temperature Coefficient: X7R; Thickness (Max): 0.022" (0.55mm); Voltage - Rated: 10V
  C406 C409 C412: Value: 100n
  C407: Value: 1u
C408 = CL10A475KA8NQNC: as C104 on sheet MCU; Part Number: CL10A475KA8NQNC; Value: 4u7; Applications: General Purpose; componentlink1description: Datasheet; componentlink1url: http://www.samsungsem.com/kr/support/product-search/mlcc/CL10A475KA8NQNC.jsp; componentlink2description: DigiKey Link; componentlink2url: https://www.digikey.com/en/products/detail/samsung-electro-mechanics/CL10A475KA8NQNC/3887558; Device Package: 0603 (1608 Metric); lastupdated: 9/02/2024 8:10:30 PM; Lifecycle Status: Active; Minimum Order: 1; Mounting Type: Surface Mount, MLCC; Operating Temperature: -55°C ~ 85°C; Package / Case: 0603 (1608 Metric); packaging: TapeAndReel; partid: 2349; Part Status: Active; price: 0.06; series: CL; Size / Dimension: 0.063" L x 0.031" W (1.60mm x 0.80mm); Supplier 1: DigiKey; Supplier Part Number 1: 1276-1900-1-ND; Temperature Coefficient: X5R; Thickness (Max): 0.035" (0.90mm); Voltage - Rated: 25V
D401 D402 = CMP-02539-000057-1: DIODE SCHOTTKY 100V 5A TO277A; Max Forward Surge Current (Ifsm): 150A; Element Configuration: Common Cathode; Max Reverse Leakage Current: 15uA; Forward Voltage: 880mV; Case/Package: TO-277A; Number of Pins: 3; Max Reverse Voltage (DC): 100V; Height: 0.031inch; Peak Non-Repetitive Surge Current: 150A; Series: eSMP®; Radiation Hardening: No; Length: 0.242inch; Max Repetitive Reverse Voltage (Vrrm): 100V; Forward Current: 5A; Width: 0.171inch; Min Operating Temperature: -55°C; Max Surge Current: 150A; Lead Free: Lead Free; RoHS Compliant: Yes; Average Rectified Current: 5A; Max Operating Temperature: 150°C; Max Reverse Current: 15uA; Package Quantity: 1500; Packaging: Tape and Reel; Mount: Surface Mount
D403 D404 = CMP-1674-00011-2: LED RED CLEAR CHIP SMD; Reverse Voltage: 5V; Viewing Angle: 130°; Power Rating: 75mW; Test Current: 20mA; Number of Elements: 1; Lens Color: Colorless; Wavelength: 639nm; Dominant Wavelength: 631nm; Lens Style: Diffused; Forward Current: 30mA; Forward Voltage: 2.4V; Luminous Intensity: 54mcd; Color: Red; Case Code (Imperial): 0603; Lens Transparency: Clear; Lead Free: Lead Free; Package Quantity: 1; Packaging: Tape and Reel; Max Operating Temperature: 85°C; Number of Pins: 2; Height: 0.8mm; Case/Package: 0603; Number of LEDs: 1; Width: 0.8mm; Case Code (Metric): 1608; Depth: 0.8mm; Mount: Surface Mount; Radiation Hardening: No; Length: 1.6mm; Illumination Color: Red; Power Dissipation: 75mW; Min Operating Temperature: -55°C
F401 = CC12H15A-TR: FUSE BOARD MOUNT 15A 32VDC 1206; Manufacturer: Eaton - Electronics Division; Approval Agency: cURus; Breaking Capacity @ Rated Voltage: 100A; Fuse Type: Board Mount (Cartridge Style Excluded); Melting I²t: 40; Voltage Rating - DC: 32V; Part Number: CC12H15A-TR; Approvals: cURus; ComponentLink1Description: Datasheet; ComponentLink1URL: http://www.cooperindustries.com/content/dam/public/bussmann/Electronics/Resources/product-datasheets/Bus_Elx_DS_4309_CC12H_Series.pdf; ComponentLink2Description: DigiKey Link; ComponentLink2URL: http://digikey.com/product-detail/en/eaton-electronics-division/CC12H15A-TR/283-4493-1-ND/5042389; Current Rating (Amps): 15A; Device Package: 1206 (3216 Metric); LastUpdated: 2/09/2020 1:30:41 AM; Lifecycle Status: Active; Minimum Order: 1; Mounting Type: Surface Mount; Operating Temperature: -55°C ~ 125°C; Package / Case: 1206 (3216 Metric); Packaging: TapeAndReel; Part Status: Active; Price: 0.39; Series: CC12H; Size / Dimension: 0.063" L x 0.126" W x 0.024" H (1.60mm x 3.20mm x 0.60mm); Supplier 1: DigiKey; Supplier Part Number 1: 283-4493-1-ND
J401 = XT60_YELLOW: Power connector; 65A; PIN: 2; Colour: yellow; MP: XT60 YELLOW; MF: Pololu; SnapEDA_Link: https://www.snapeda.com/parts/XT60%20YELLOW/Pololu/view-part/?ref=snap; Availability: Not in stock; Package: None; Check_prices: https://www.snapeda.com/parts/XT60%20YELLOW/Pololu/view-part/?ref=eda; Value: *; Price: None
L401 = CMP-02424-000442-1: Commercial Inductors, Low DCR Series 1uH 25A 2.5mΩ 20%; Saturation Current: 20A; Self Resonant Frequency: 1MHz; Shielding: Shielded; Core Material: Metal; DC Resistance (DCR): 2.5mR; Test Frequency: 100kHz; Min Operating Temperature: -55°C; Package Quantity: 1; Depth: 10.3mm; Case Code (Imperial): 4040; Height - Seated (Max): 0.157inch; Width: 0.405inch; RMS Current (Irms): 25A; Height: 4mm; Length: 0.43inch; Packaging: Tape and Reel; Inductance: 1uH; Number of Pins: 2; Military Standard: Not; Current Rating: 25A; Lead Free: Lead Free; Mount: Surface Mount; Case/Package: 4040; Tolerance: 20%; Termination: SMD/SMT; Radiation Hardening: No; Inductance Tolerance: 20%; Max DC Current: 20A; Max Operating Temperature: 125°C
Q401 = ZXMP6A13FTA: MOSFET P-CH 60V 900MA SOT23-3; Manufacturer: Diodes Incorporated; Current - Continuous Drain (Id) @ 25°C: 900mA (Ta); Drive Voltage (Max Rds On,  Min Rds On): 4.5V, 10V; FET Type: P-Channel; Gate Charge (Qg) (Max) @ Vgs: 5.9 nC @ 10 V; Input Capacitance (Ciss) (Max) @ Vds: 219 pF @ 30 V; Power Dissipation (Max): 625mW (Ta); Rds On (Max) @ Id, Vgs: 400mOhm @ 900mA, 10V; Vgs (Max): ±20V; Vgs(th) (Max) @ Id: 3V @ 250µA; Part Number: ZXMP6A13FTA; ComponentLink1Description: Datasheet; ComponentLink1URL: https://www.diodes.com/assets/Datasheets/ZXMP6A13F.pdf; ComponentLink2Description: DigiKey Link; ComponentLink2URL: https://www.digikey.com/en/products/detail/diodes-incorporated/ZXMP6A13FTA/560639; Drain to Source Voltage (Vdss): 60 V; LastUpdated: 11/03/2024 8:04:08 AM; Lifecycle Status: Active; Minimum Order: 1; Mounting Type: Surface Mount; Operating Temperature: -55°C ~ 150°C (TJ); Package / Case: TO-236-3, SC-59, SOT-23-3; Packaging: TapeAndReel; Part Status: Active; Price: 0.16; Series: -; Supplier 1: DigiKey; Supplier Part Number 1: ZXMP6A13FCT-ND; Supplier Device Package: SOT-23-3; Technology: MOSFET (Metal Oxide)
R401-R410 = AC0402JR-075K1L: as R101 on sheet MCU; Part Number: AC0402JR-075K1L; ComponentLink1Description: Datasheet; ComponentLink1URL: https://www.yageo.com/upload/media/product/productsearch/datasheet/rchip/PYu-AC_51_RoHS_L_7.pdf; ComponentLink2Description: DigiKey Link; ComponentLink2URL: https://www.digikey.com/en/products/detail/yageo/AC0402JR-075K1L/5895695; Composition: Thick Film; Device Package: 0402 (1005 Metric); Features: Automotive AEC-Q200, Moisture Resistant; Height - Seated (Max): 0.015" (0.37mm); LastUpdated: 9/02/2024 8:30:14 PM; Lifecycle Status: Active; Minimum Order: 1; Number of Terminations: 2; Operating Temperature: -55°C ~ 155°C; Package / Case: 0402 (1005 Metric); Packaging: CutTape; PartId: 4690; Part Status: Active; Price: 0.01; Ratings: AEC-Q200; Series: AC; Size / Dimension: 0.039" L x 0.020" W (1.00mm x 0.50mm); Supplier 1: DigiKey; Supplier Part Number 1: YAG3554CT-ND; Supplier Device Package: 0402; Tolerance: ±5%
  R401 R402: Value: 100K
  R403: Value: 562K
  R404: Value: 310K
  R405: Value: 200K
  R406: Value: 500K
  R407: Value: 110K
  R408: Value: 10K
  R409 R410: Value: 5K1
U401 = CMP-209535-000001-1: LDO Voltage Regulators 1A, 3.3V; Manufacturer: Advanced Monolithic Systems; Dropout Voltage: 1.1V; Output Type: Fixed; Nominal Supply Current: 5mA; Max Power Dissipation: 1.2W; Max Supply Voltage: 15V; Number Of Outputs: 1; Standoff Height: 0.64mm; Max Junction Temp: +125°C; Height: 1.8mm; Package: AMS1117; Device Class L2: Power Management ICs; ComponentLink2Description: Datasheet; ComponentLink2URL: http://www.advanced-monolithic.com/pdf/ds1117.pdf; Category: IC; RoHS: TRUE; Automotive: No; Device Class L1: Integrated Circuits (ICs); Output Current: 1A; Device Class L3: Voltage Regulators - Linear; Temperature: -40°C to +125°C; Output Voltage: 3.3V; Manufacturer Part Number: AMS1117-3.3; Temperature Range Low: -40°C; Octopart: https://octopart.com/ams1117-3.3-advanced+monolithic+systems-25899300; Lead Free: Yes; Ipc Land Pattern Name: SOT229P700X180-4; Temperature Range High: +125°C
U402 = CMP-00030-87948104-1: SIC431AED-T1-GE3 IC Reg Buck Adj 24A MLP44-24; Max Supply Voltage: 24V; Number of Outputs: 1; Max Junction Temperature (Tj): 125°C; Min Supply Voltage: 3V; Output Voltage: 20V; NexarPartId: 87948104; Min Operating Temperature: -40°C; Schedule B: 8542390000, 8542390000; RoHS: Non-Compliant; Max Operating Temperature: 125°C; Height: 800µm; Ambient Temperature Range High: 105°C; Output Current: 24A

## Nets that join several sheets
+3V3: MCU (C106.1 C107.2 R101.2 U101.2), Motors (R201.2 R202.1 U201.28 U202.16), Limit Switches (26 pins), Power (C402.2 D404.2 U401.2 U401.4)
+5V: MCU (5 pins), Power (Q401.2 R402.2)
+7v: Motors (14 pins), Power (12 pins)
GND: MCU (19 pins), Motors (25 pins), Limit Switches (52 pins), Power (27 pins)
L1.1: MCU (U101.38), Limit Switches (D301.2 J301.1)
L1.2: MCU (U101.36), Limit Switches (D302.2 J302.1)
L1.3: MCU (U101.5), Limit Switches (D303.2 J303.1)
L1.4: MCU (U101.31), Limit Switches (D304.2 J304.1)
L2.1: MCU (U101.33), Limit Switches (D305.2 J305.1)
L2.2: MCU (U101.35), Limit Switches (D306.2 J306.1)
L2.3: MCU (U101.23), Limit Switches (D307.2 J307.1)
L2.4: MCU (U101.21), Limit Switches (D308.2 J308.1)
L3.1: MCU (U101.19), Limit Switches (D309.2 J309.1)
L3.2: MCU (U101.17), Limit Switches (D310.2 J310.1)
L3.3: MCU (U101.15), Limit Switches (D311.2 J311.1)
L3.4: MCU (U101.11), Limit Switches (D312.2 J312.1)
L4.1: MCU (U101.39), Limit Switches (D313.2 J313.1)
L4.2: MCU (U101.37), Limit Switches (D314.2 J314.1)
L4.3: MCU (U101.4), Limit Switches (D315.2 J315.1)
L4.4: MCU (U101.6), Limit Switches (D316.2 J316.1)
L5.1: MCU (U101.32), Limit Switches (D317.2 J317.1)
L5.2: MCU (U101.34), Limit Switches (D318.2 J318.1)
L5.3: MCU (U101.24), Limit Switches (D319.2 J319.1)
L5.4: MCU (U101.22), Limit Switches (D320.2 J320.1)
L6.1: MCU (U101.20), Limit Switches (D321.2 J321.1)
L6.2: MCU (U101.18), Limit Switches (D322.2 J322.1)
L6.3: MCU (U101.16), Limit Switches (D323.2 J323.1)
L6.4: MCU (U101.12), Limit Switches (D324.2 J324.1)
L7.1: MCU (U101.10), Limit Switches (D326.2 J326.1)
L7.2: MCU (U101.9), Limit Switches (D327.2 J327.1)
MEN: MCU (U101.25), Motors (U202.1)
MIN1: MCU (U101.27), Motors (U202.2)
MIN2: MCU (U101.26), Motors (U202.7)
SCL: MCU (U101.7), Motors (R202.2 U201.26)
SDA: MCU (U101.8), Motors (R201.1 U201.27)